# EAGLE schematic Calliope mini rev1.3 (EAGLE 7.7.0)
Assembly variants: -1

## Sheet 1 of 2
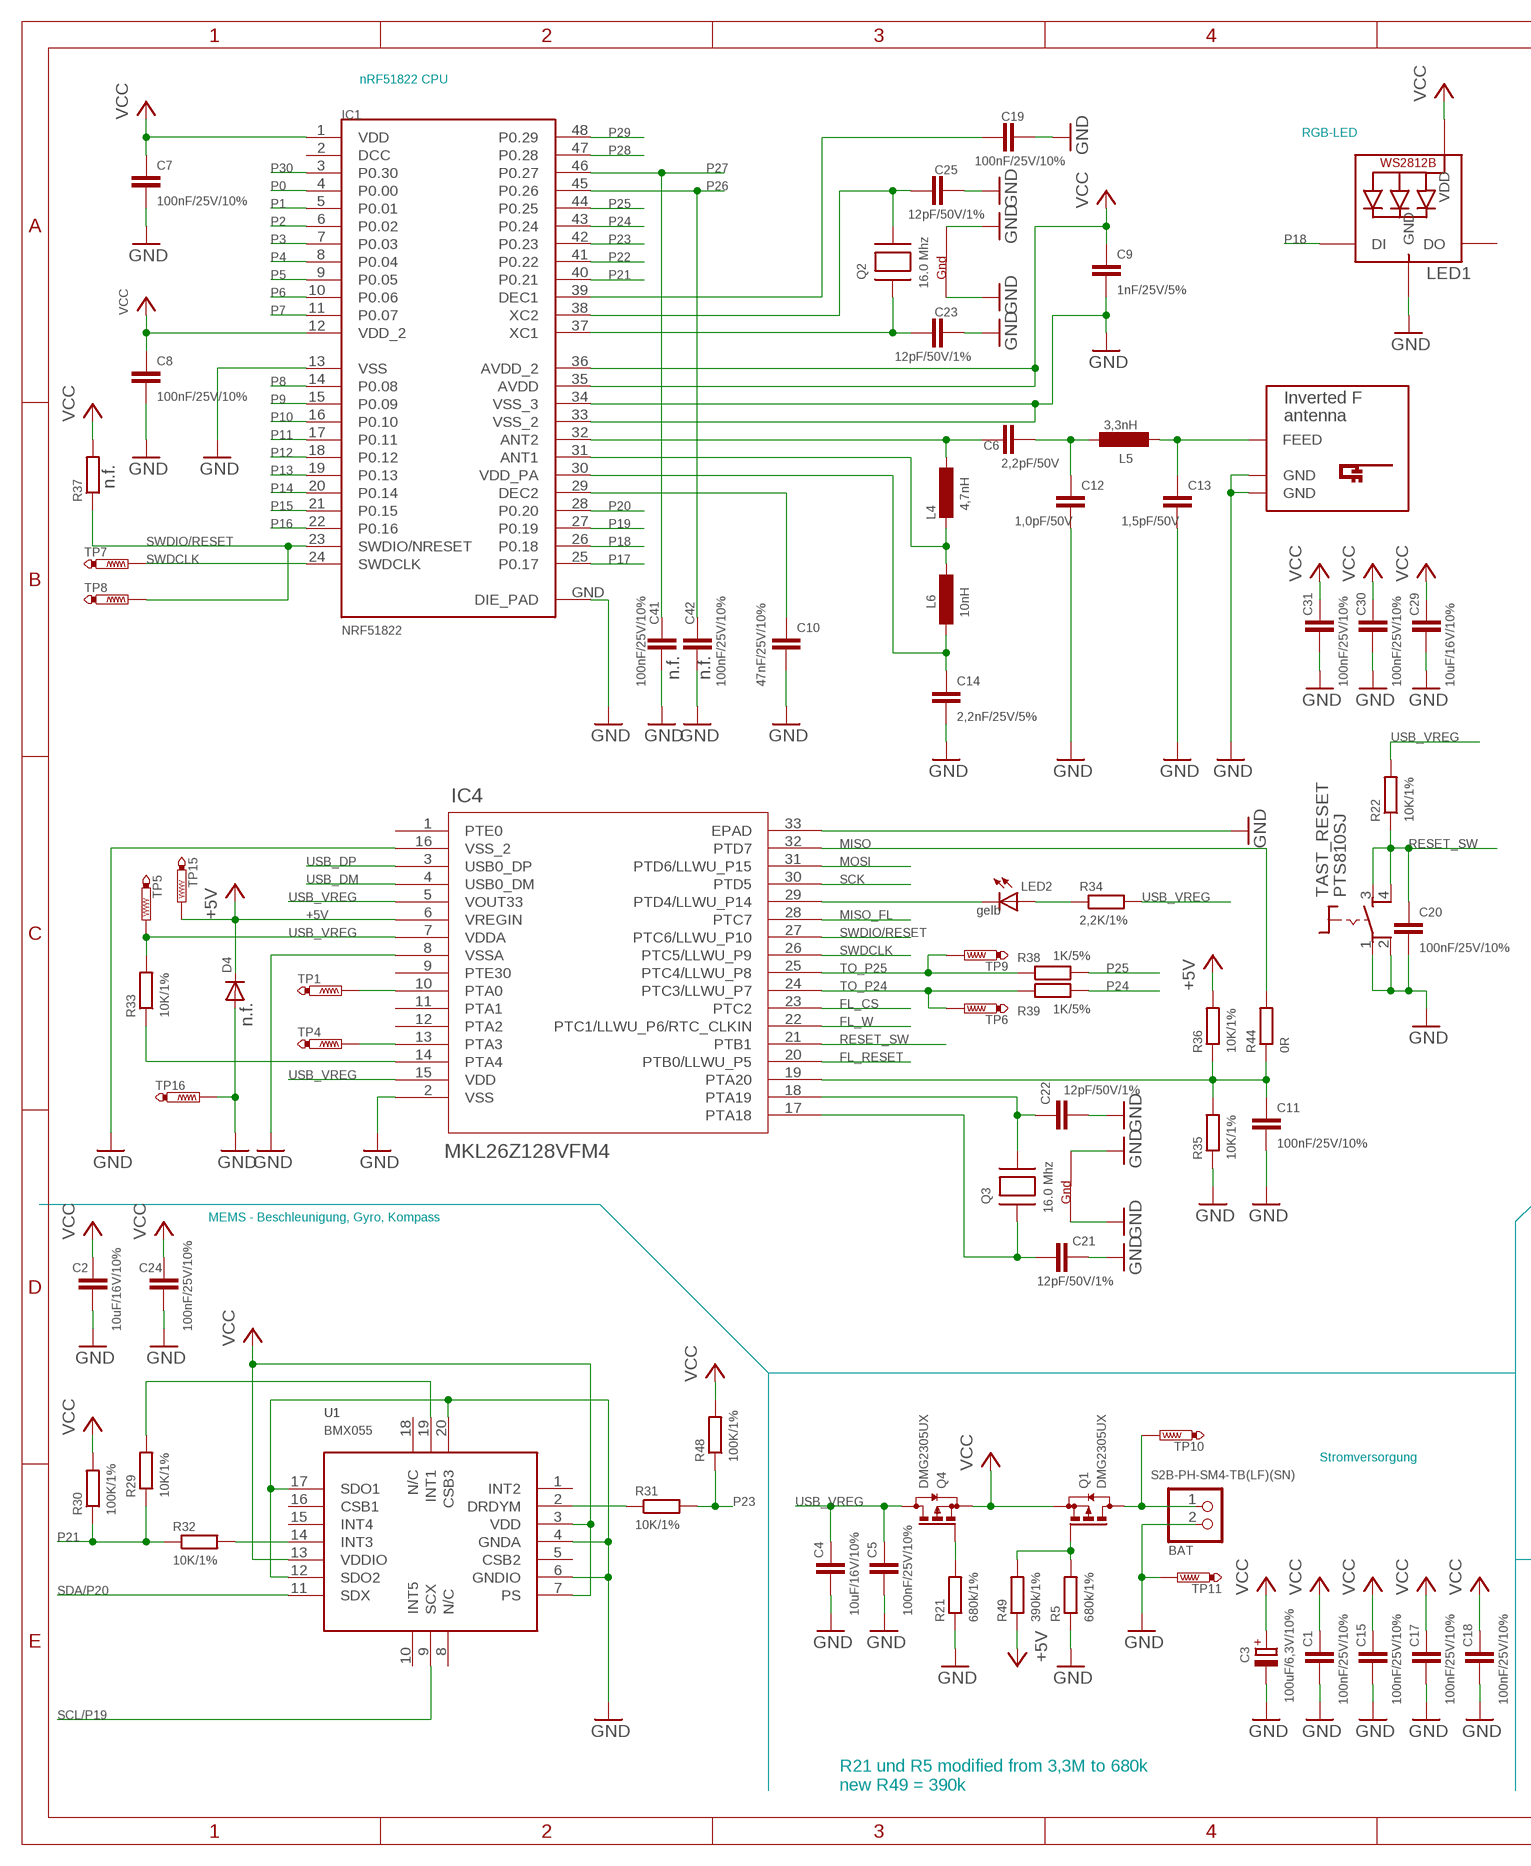
[diagram p0: schematic, sheet 1, part 1 of 2]
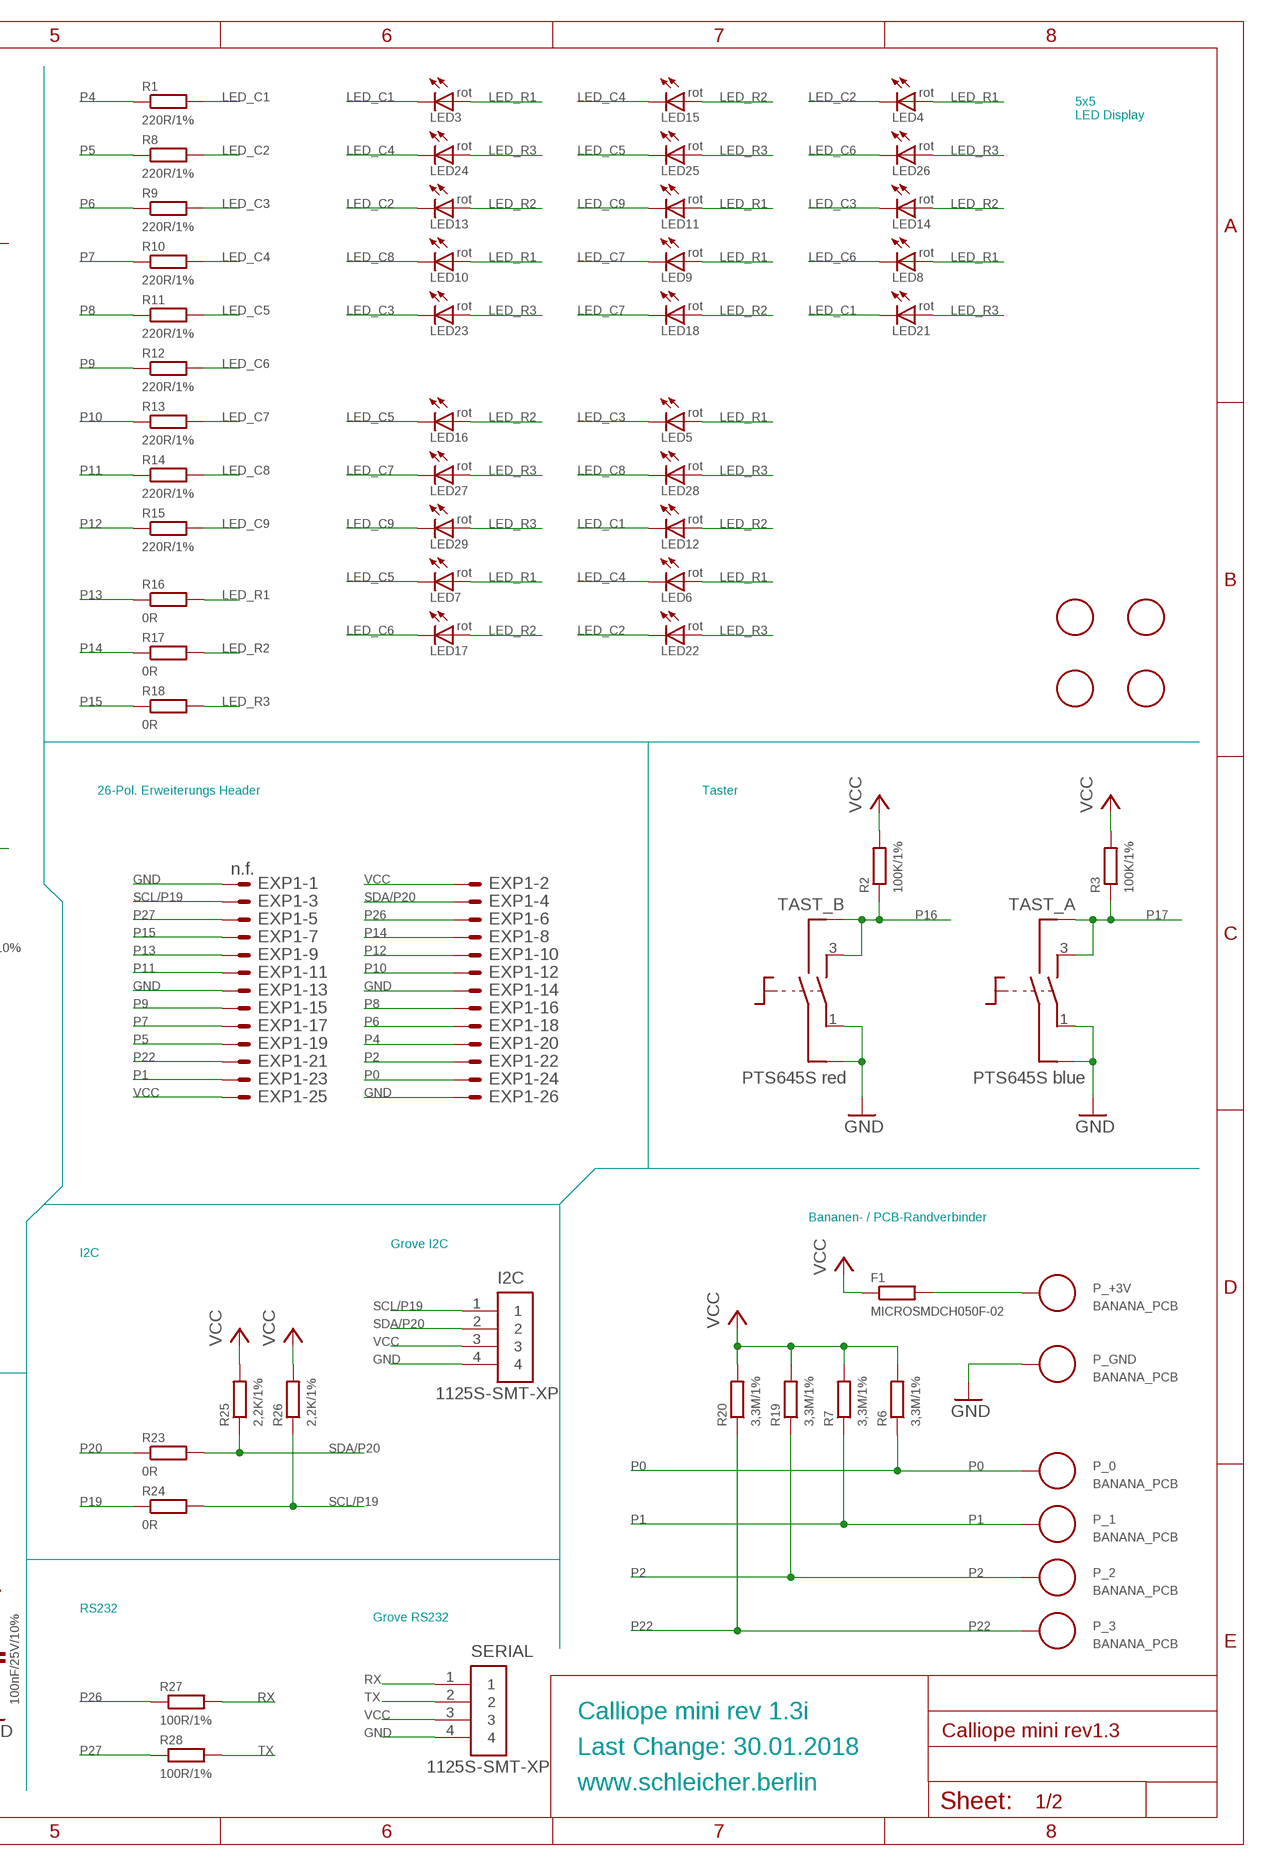
[diagram p1: schematic, sheet 1, part 2 of 2]

### Parts
BAT  S2B-PH-SM4-TB(LF)(SN)  JST_2PIN-SMT-RA  [JST-PH-2-SMT-RA]
C1  100nF/25V/10%  C-EU0402  [0402]
C2  10uF/16V/10%  C-EU0603  [0603]
C3  100uF/6,3V/10%  CPOL-EUD/7343-31R  [D/7343-31R]
C4  10uF/16V/10%  C-EU0603  [0603]
C5  100nF/25V/10%  C-EU0402  [0402]
C6  2,2pF/50V  C-EU0402  [0402]
C7  100nF/25V/10%  C-EU0402  [0402]
C8  100nF/25V/10%  C-EU0402  [0402]
C9  1nF/25V/5%  C-EU0402  [0402]
C10  47nF/25V/10%  C-EU0402  [0402]
C11  100nF/25V/10%  C-EU0402  [0402]
C12  1,0pF/50V  C-EU0402  [0402]
C13  1,5pF/50V  C-EU0402  [0402]
C14  2,2nF/25V/5%  C-EU0402  [0402]
C15  100nF/25V/10%  C-EU0402  [0402]
C17  100nF/25V/10%  C-EU0402  [0402]
C18  100nF/25V/10%  C-EU0402  [0402]
C19  100nF/25V/10%  C-EU0402  [0402]
C20  100nF/25V/10%  C-EU0402  [0402]
C21  12pF/50V/1%  C-EU0402  [0402]
C22  12pF/50V/1%  C-EU0402  [0402]
C23  12pF/50V/1%  C-EU0402  [0402]
C24  100nF/25V/10%  C-EU0402  [0402]
C25  12pF/50V/1%  C-EU0402  [0402]
C29  10uF/16V/10%  C-EU0603  [0603]
C30  100nF/25V/10%  C-EU0402  [0402]
C31  100nF/25V/10%  C-EU0402  [0402]
C41  100nF/25V/10%  C-EU0402  [0402]  (not fitted in variant -1)
C42  100nF/25V/10%  C-EU0402  [0402]  (not fitted in variant -1)
D4  DIODE-SOD323-R  [SOD323-R]  (not fitted in variant -1)
EXP1  ML26E  [ML26]  (not fitted in variant -1)
F1  MICROSMDCH050F-02  R-EU_R1210  [R1210]
I2C  1125S-SMT-XP  [1125S-SMT-XP]
IC1  NRF51822  [QFN48]
IC4  MKL26Z128VFM4  MKL26Z  [QFN_32_5X5X0P9]
L4  4,7nH  L-EU0402  [0402]
L5  3,3nH  L-EU0402  [0402]
L6  10nH  L-EU0402  [0402]
LED1  SK6812MINI  WS2812B3535  [LED3535]
LED2  gelb  LEDCHIPLED_0603  [CHIPLED_0603]
LED3  rot  LEDCHIPLED_0603  [CHIPLED_0603]
LED4  rot  LEDCHIPLED_0603  [CHIPLED_0603]
LED5  rot  LEDCHIPLED_0603  [CHIPLED_0603]
LED6  rot  LEDCHIPLED_0603  [CHIPLED_0603]
LED7  rot  LEDCHIPLED_0603  [CHIPLED_0603]
LED8  rot  LEDCHIPLED_0603  [CHIPLED_0603]
LED9  rot  LEDCHIPLED_0603  [CHIPLED_0603]
LED10  rot  LEDCHIPLED_0603  [CHIPLED_0603]
LED11  rot  LEDCHIPLED_0603  [CHIPLED_0603]
LED12  rot  LEDCHIPLED_0603  [CHIPLED_0603]
LED13  rot  LEDCHIPLED_0603  [CHIPLED_0603]
LED14  rot  LEDCHIPLED_0603  [CHIPLED_0603]
LED15  rot  LEDCHIPLED_0603  [CHIPLED_0603]
LED16  rot  LEDCHIPLED_0603  [CHIPLED_0603]
LED17  rot  LEDCHIPLED_0603  [CHIPLED_0603]
LED18  rot  LEDCHIPLED_0603  [CHIPLED_0603]
LED21  rot  LEDCHIPLED_0603  [CHIPLED_0603]
LED22  rot  LEDCHIPLED_0603  [CHIPLED_0603]
LED23  rot  LEDCHIPLED_0603  [CHIPLED_0603]
LED24  rot  LEDCHIPLED_0603  [CHIPLED_0603]
LED25  rot  LEDCHIPLED_0603  [CHIPLED_0603]
LED26  rot  LEDCHIPLED_0603  [CHIPLED_0603]
LED27  rot  LEDCHIPLED_0603  [CHIPLED_0603]
LED28  rot  LEDCHIPLED_0603  [CHIPLED_0603]
LED29  rot  LEDCHIPLED_0603  [CHIPLED_0603]
P_0  BANANA_PCB  [BANANA_REC]  (not fitted in variant -1)
P_1  BANANA_PCB  [BANANA_REC]  (not fitted in variant -1)
P_2  BANANA_PCB  [BANANA_REC]  (not fitted in variant -1)
P_3  BANANA_PCB  [BANANA_REC]  (not fitted in variant -1)
P_+3V  BANANA_PCB  [BANANA_REC]  (not fitted in variant -1)
P_GND  BANANA_PCB  [BANANA_REC]  (not fitted in variant -1)
Q1  DMG2305UX  BSS84  [SOT23]
Q2  16.0 Mhz  XTAL-4-3225  [NX3225]
Q3  16.0 Mhz  XTAL-4-3225  [NX3225]
Q4  DMG2305UX  BSS84  [SOT23]
R1  220R/1%  R-EU_0402  [0402]
R2  100K/1%  R-EU_0402  [0402]
R3  100K/1%  R-EU_0402  [0402]
R5  680k/1%  R-EU_0402  [0402]
R6  3,3M/1%  R-EU_0402  [0402]
R7  3,3M/1%  R-EU_0402  [0402]
R8  220R/1%  R-EU_0402  [0402]
R9  220R/1%  R-EU_0402  [0402]
R10  220R/1%  R-EU_0402  [0402]
R11  220R/1%  R-EU_0402  [0402]
R12  220R/1%  R-EU_0402  [0402]
R13  220R/1%  R-EU_0402  [0402]
R14  220R/1%  R-EU_0402  [0402]
R15  220R/1%  R-EU_0402  [0402]
R16  0R  R-EU_0402  [0402]
R17  0R  R-EU_0402  [0402]
R18  0R  R-EU_0402  [0402]
R19  3,3M/1%  R-EU_0402  [0402]
R20  3,3M/1%  R-EU_0402  [0402]
R21  680k/1%  R-EU_0402  [0402]
R22  10K/1%  R-EU_0402  [0402]
R23  0R  R-EU_0402  [0402]
R24  0R  R-EU_0402  [0402]
R25  2,2K/1%  R-EU_0402  [0402]
R26  2,2K/1%  R-EU_0402  [0402]
R27  100R/1%  R-EU_0402  [0402]
R28  100R/1%  R-EU_0402  [0402]
R29  10K/1%  R-EU_0402  [0402]
R30  100K/1%  R-EU_0402  [0402]
R31  10K/1%  R-EU_0402  [0402]
R32  10K/1%  R-EU_0402  [0402]
R33  10K/1%  R-EU_0402  [0402]
R34  2,2K/1%  R-EU_0402  [0402]
R35  10K/1%  R-EU_0402  [0402]
R36  10K/1%  R-EU_0402  [0402]
R37  R-EU_0402  [0402]  (not fitted in variant -1)
R38  1K/5%  R-EU_0402  [0402]
R39  1K/5%  R-EU_0402  [0402]
R44  0R  R-EU_0402  [0402]
R48  100K/1%  R-EU_0402  [0402]
R49  390k/1%  R-EU_0402  [0402]
SERIAL  1125S-SMT-XP  [1125S-SMT-XP]
TAST_A  PTS645S blue  PTS645S  [PTS645S]
TAST_B  PTS645S red  PTS645S  [PTS645S]
TAST_RESET  PTS810SJ  [PTS810]
TP1  PTR1B1,27  [B1,27]  (not fitted in variant -1)
TP4  PTR1B1,27  [B1,27]  (not fitted in variant -1)
TP5  PTR1B1,27  [B1,27]  (not fitted in variant -1)
TP6  PTR1B1,27  [B1,27]  (not fitted in variant -1)
TP7  PTR1B1,27  [B1,27]  (not fitted in variant -1)
TP8  PTR1B1,27  [B1,27]  (not fitted in variant -1)
TP9  PTR1B1,27  [B1,27]  (not fitted in variant -1)
TP10  PTR1B1,27  [B1,27]  (not fitted in variant -1)
TP11  PTR1B1,27  [B1,27]  (not fitted in variant -1)
TP15  PTR1B1,27  [B1,27]  (not fitted in variant -1)
TP16  PTR1B1,27  [B1,27]  (not fitted in variant -1)
U1  BMX055  [BMX055]
U$2  INVERTED_F_ANTENNA  [DN0007+0_MIRROR]  (not fitted in variant -1)
U$5  FIDUCIAL  [FIDUCIAL_1MM]  (not fitted in variant -1)
U$6  FIDUCIAL  [FIDUCIAL_1MM]  (not fitted in variant -1)
U$7  FIDUCIAL  [FIDUCIAL_1MM]  (not fitted in variant -1)
U$8  FIDUCIAL  [FIDUCIAL_1MM]  (not fitted in variant -1)

### Nets
+5V: D4.C IC4.6(VREGIN) R36.2 R49.1 TP15.TP ; also sheet 2
FL_CS: IC4.23(PTC2) ; also sheet 2
FL_RESET: IC4.20(PTB0/LLWU_P5) ; also sheet 2
FL_W: IC4.22(PTC1/LLWU_P6/RTC_CLKIN) ; also sheet 2
GND: BAT.2 C1.2 C2.2 C3.- C4.2 C5.2 C7.2 C8.2 C9.2 C10.2 C11.2 C12.2 C13.2 C14.2 C15.2 C17.2 C18.2 C19.2 C20.2 C21.2 C22.2 C23.2 C24.2 C25.2 C29.2 C30.2 C31.2 C41.2 C42.2 D4.A EXP1.1 EXP1.13 EXP1.14 EXP1.26 I2C.4 IC1.13(VSS) IC1.33(VSS_2) IC1.34(VSS_3) IC1.GND(DIE_PAD) IC4.2(VSS) IC4.8(VSSA) IC4.16(VSS_2) IC4.33(EPAD) LED1.4(GND) P_GND.1 Q2.2(G2) Q2.4(G1) Q3.2(G2) Q3.4(G1) R5.1 R21.1 R35.1 SERIAL.4 TAST_A.1 TAST_A.2 TAST_B.1 TAST_B.2 TAST_RESET.1(P) TAST_RESET.2(P1) TP11.TP TP16.TP U1.4(GNDA) U1.6(GNDIO) U1.12(SDO2) U1.17(SDO1) U1.20(CSB3) U$2.GND U$2.GND@1(GND) ; also sheet 2
LED_C1: LED3.A LED12.A LED21.A R1.2
LED_C2: LED4.A LED13.A LED22.A R8.2
LED_C3: LED5.A LED14.A LED23.A R9.2
LED_C4: LED6.A LED15.A LED24.A R10.2
LED_C5: LED7.A LED16.A LED25.A R11.2
LED_C6: LED8.A LED17.A LED26.A R12.2
LED_C7: LED9.A LED18.A LED27.A R13.2
LED_C8: LED10.A LED28.A R14.2
LED_C9: LED11.A LED29.A R15.2
LED_R1: LED3.C LED4.C LED5.C LED6.C LED7.C LED8.C LED9.C LED10.C LED11.C R16.2
LED_R2: LED12.C LED13.C LED14.C LED15.C LED16.C LED17.C LED18.C R17.2
LED_R3: LED21.C LED22.C LED23.C LED24.C LED25.C LED26.C LED27.C LED28.C LED29.C R18.2
MISO: IC4.32(PTD7) R44.2 ; also sheet 2
MISO_FL: IC4.28(PTC7) ; also sheet 2
MOSI: IC4.31(PTD6/LLWU_P15) ; also sheet 2
N$2: C25.1 IC1.38(XC2) Q2.3(X2)
N$3: R29.2 U1.19(INT1)
N$4: IC4.14(PTA4) R33.1
N$5: IC4.29(PTD4/LLWU_P14) LED2.A
N$6: R32.2 U1.14(INT3)
N$7: Q1.1(G) R5.2 R49.2
N$8: LED2.C R34.1
N$9: F1.2 P_+3V.1
N$11: C22.1 IC4.18(PTA19) Q3.3(X2)
N$13: C23.1 IC1.37(XC1) Q2.1(X1)
N$14: C14.1 IC1.30(VDD_PA) L6.1
N$15: C6.1 IC1.32(ANT2) L4.1
N$16: C6.2 C12.1 L5.1
N$17: C13.1 L5.2 U$2.FEED
N$18: IC1.31(ANT1) L4.2 L6.2
N$19: C19.1 IC1.39(DEC1)
N$20: C21.1 IC4.17(PTA18) Q3.1(X1)
N$21: Q4.1(G) R21.2
N$22: C10.1 IC1.29(DEC2)
N$23: R31.1 U1.2(DRDYM)
N$27: C11.1 IC4.19(PTA20) R35.2 R36.1 R44.1
P0: EXP1.24 IC1.4(P0.00) P_0.1 R6.1
P1: EXP1.23 IC1.5(P0.01) P_1.1 R7.1
P2: EXP1.22 IC1.6(P0.02) P_2.1 R19.1
P3: IC1.7(P0.03) ; also sheet 2
P4: EXP1.20 IC1.8(P0.04) R1.1
P5: EXP1.19 IC1.9(P0.05) R8.1
P6: EXP1.18 IC1.10(P0.06) R9.1
P7: EXP1.17 IC1.11(P0.07) R10.1
P8: EXP1.16 IC1.14(P0.08) R11.1
P9: EXP1.15 IC1.15(P0.09) R12.1
P10: EXP1.12 IC1.16(P0.10) R13.1
P11: EXP1.11 IC1.17(P0.11) R14.1
P12: EXP1.10 IC1.18(P0.12) R15.1
P13: EXP1.9 IC1.19(P0.13) R16.1
P14: EXP1.8 IC1.20(P0.14) R17.1
P15: EXP1.7 IC1.21(P0.15) R18.1
P16: IC1.22(P0.16) R2.1 TAST_B.3(S1) TAST_B.4(S2)
P17: IC1.25(P0.17) R3.1 TAST_A.3(S1) TAST_A.4(S2)
P18: IC1.26(P0.18) LED1.1(DI)
P19: IC1.27(P0.19) R24.1
P20: IC1.28(P0.20) R23.1
P21: IC1.40(P0.21) R29.1 R30.1 R32.1
P22: EXP1.21 IC1.41(P0.22) P_3.1 R20.1
P23: IC1.42(P0.23) R31.2 R48.1
P24: IC1.43(P0.24) R39.2
P25: IC1.44(P0.25) R38.2
P26: C42.1 EXP1.6 IC1.45(P0.26) R27.1
P27: C41.1 EXP1.5 IC1.46(P0.27) R28.1
P28: IC1.47(P0.28) ; also sheet 2
P29: IC1.48(P0.29) ; also sheet 2
P30: IC1.3(P0.30) ; also sheet 2
RESET_SW: C20.1 IC4.21(PTB1) R22.1 TAST_RESET.3(S) TAST_RESET.4(S1)
RX: R27.2 SERIAL.1
SCK: IC4.30(PTD5) ; also sheet 2
SCL/P19: EXP1.3 I2C.1 R24.2 R26.1 U1.9(SCX)
SDA/P20: EXP1.4 I2C.2 R23.2 R25.1 U1.11(SDX)
SWCLK: IC4.10(PTA0) TP1.TP
SWDCLK: IC1.24(SWDCLK) IC4.26(PTC5/LLWU_P9) TP7.TP
SWDIO: IC4.13(PTA3) TP4.TP
SWDIO/RESET: IC1.23(SWDIO/NRESET) IC4.27(PTC6/LLWU_P10) R37.1 TP8.TP
TO_P24: IC4.24(PTC3/LLWU_P7) R39.1 TP6.TP
TO_P25: IC4.25(PTC4/LLWU_P8) R38.1 TP9.TP
TX: R28.2 SERIAL.2
USB_DM: IC4.4(USB0_DM) ; also sheet 2
USB_DP: IC4.3(USB0_DP) ; also sheet 2
USB_VREG: C4.1 C5.1 IC4.5(VOUT33) IC4.7(VDDA) IC4.15(VDD) Q4.3(D) R22.2 R33.2 R34.2 TP5.TP ; also sheet 2
VCC: C1.1 C2.1 C3.+ C7.1 C8.1 C9.1 C15.1 C17.1 C18.1 C24.1 C29.1 C30.1 C31.1 EXP1.2 EXP1.25 F1.1 I2C.3 IC1.1(VDD) IC1.12(VDD_2) IC1.35(AVDD) IC1.36(AVDD_2) LED1.2(VDD) Q1.2(S) Q4.2(S) R2.2 R3.2 R6.2 R7.2 R19.2 R20.2 R25.2 R26.2 R30.2 R37.2 R48.2 SERIAL.3 U1.3(VDD) U1.7(PS) U1.13(VDDIO) ; also sheet 2
VIN: BAT.1 Q1.3(D) TP10.TP
Unconnected: IC1.2(DCC) IC4.1(PTE0) IC4.9(PTE30) IC4.11(PTA1) IC4.12(PTA2) LED1.3(DO) U1.1(INT2) U1.5(CSB2) U1.8(N/C) U1.10(INT5) U1.15(INT4) U1.16(CSB1) U1.18(N/C)

### Notes on the sheet
- nRF51822 CPU
- 5x5
  LED Display
- RGB-LED
- LED1
- 26-Pol. Erweiterungs Header | Taster
- MEMS - Beschleunigung, Gyro, Kompass | Bananen- / PCB-Randverbinder
- Grove I2C
- I2C
- Stromversorgung
- RS232
- Grove RS232
- Calliope mini rev 1.3i
- Last Change: 30.01.2018
- R21 und R5 modified from 3,3M to 680k
  new R49 = 390k
- www.schleicher.berlin

## Sheet 2 of 2
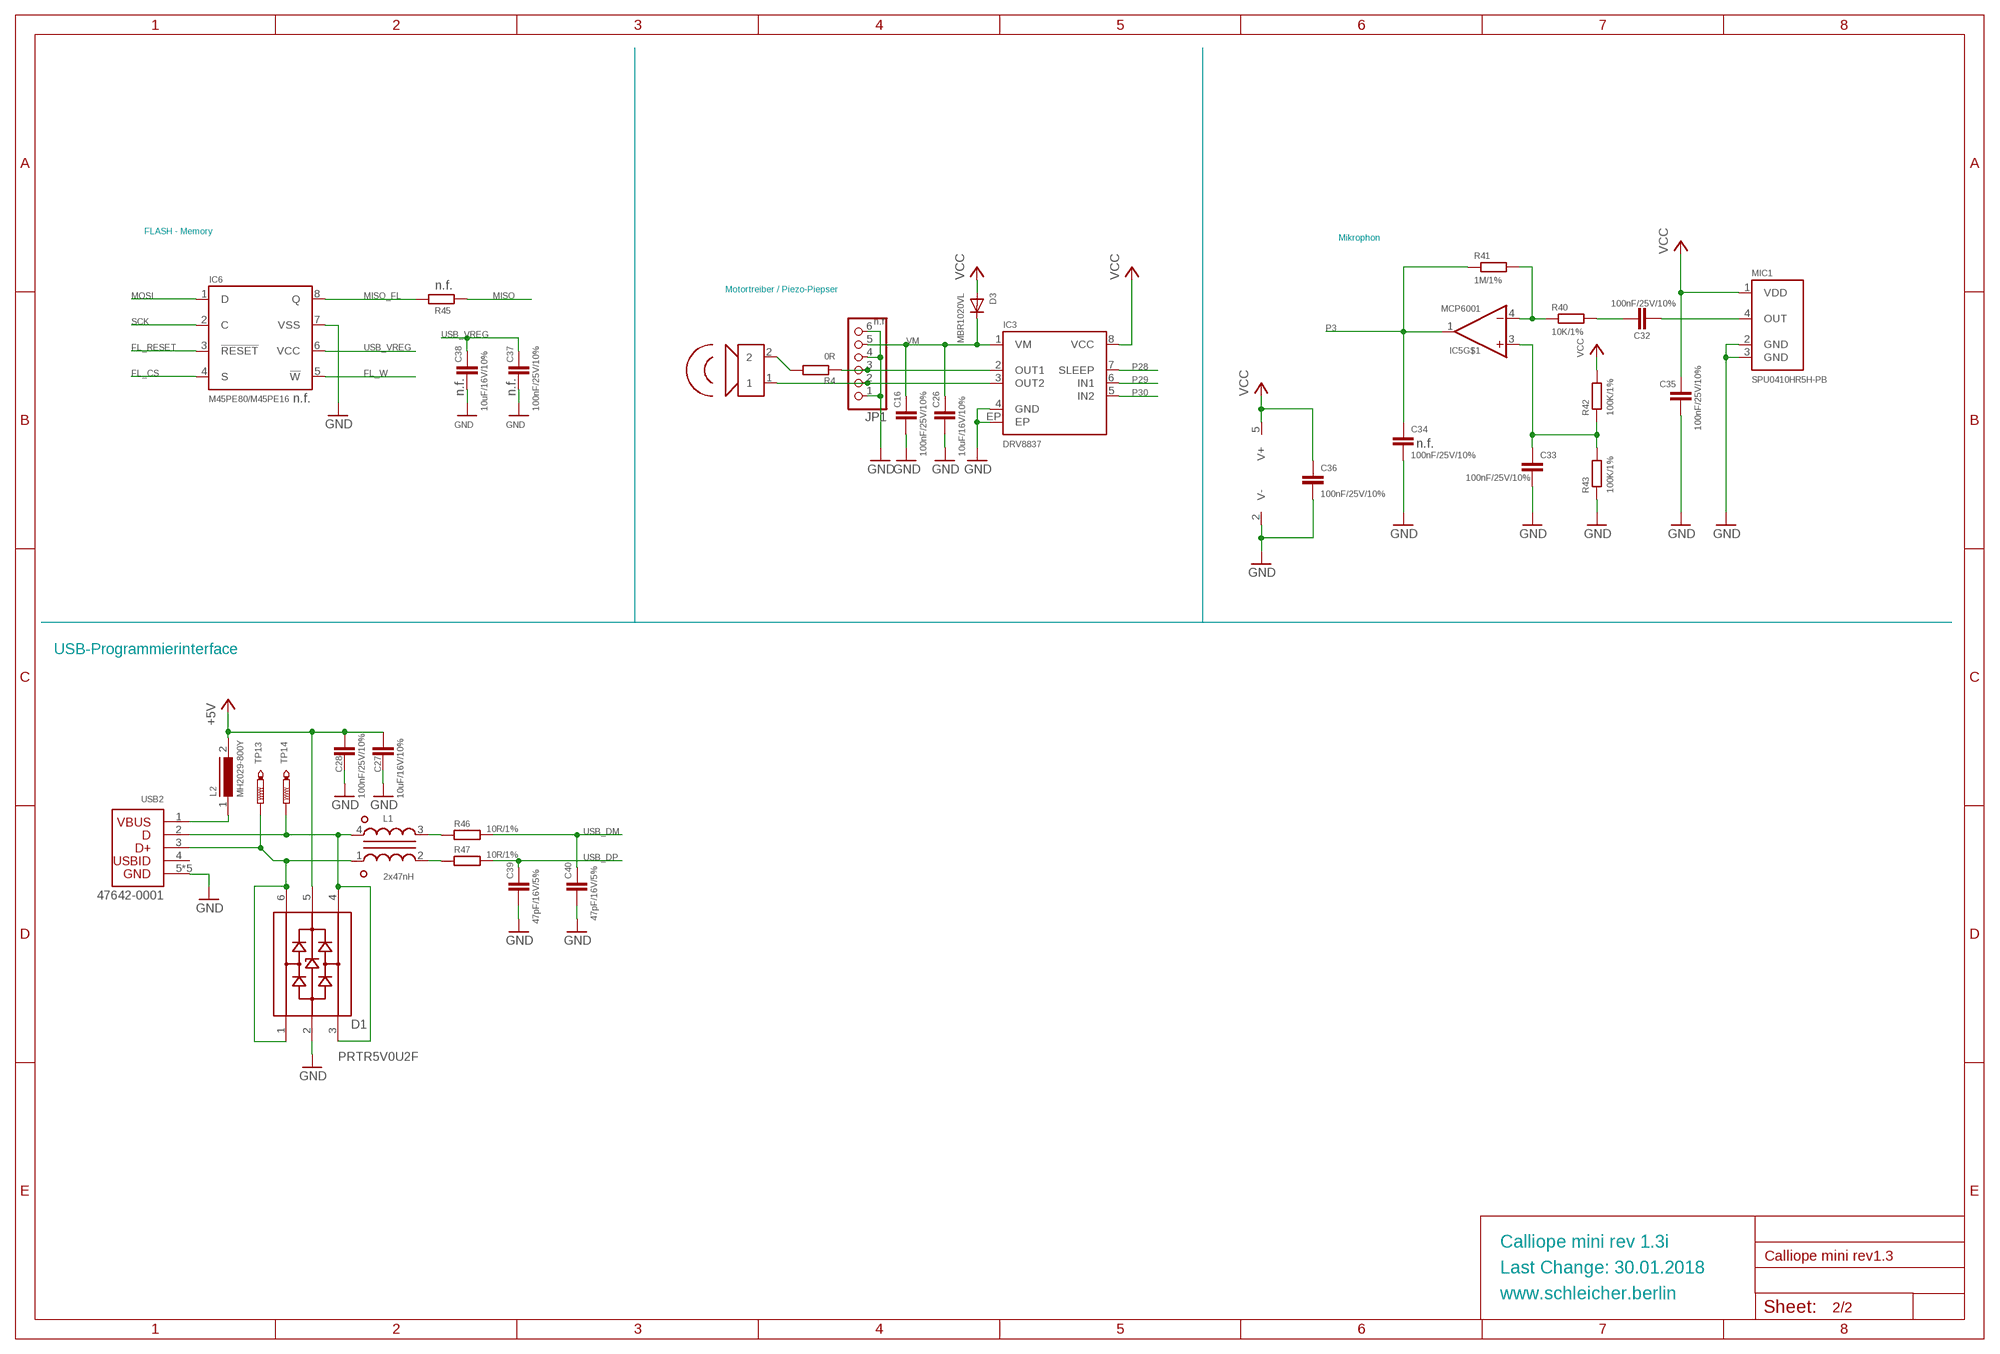
[diagram p2: schematic, sheet 2]

### Parts
C16  100nF/25V/10%  C-EU0402  [0402]
C26  10uF/16V/10%  C-EU0603  [0603]
C27  10uF/16V/10%  C-EU0603  [0603]
C28  100nF/25V/10%  C-EU0402  [0402]
C32  100nF/25V/10%  C-EU0402  [0402]
C33  100nF/25V/10%  C-EU0402  [0402]
C34  100nF/25V/10%  C-EU0402  [0402]  (not fitted in variant -1)
C35  100nF/25V/10%  C-EU0402  [0402]
C36  100nF/25V/10%  C-EU0402  [0402]
C37  100nF/25V/10%  C-EU0402  [0402]  (not fitted in variant -1)
C38  10uF/16V/10%  C-EU0603  [0603]  (not fitted in variant -1)
C39  47pF/16V/5%  C-EU0402  [0402]
C40  47pF/16V/5%  C-EU0402  [0402]
D1  PRTR5V0U2F  [SOT886]
D3  MBR1020VL  DIODE_SOD-123FL  [SOD-123FL]
IC3  DRV8837  [WSON8]
IC5  MCP6001  OPAMP_SINGLESOT23-5  [SOT23-5]
IC6  M45PE80/M45PE16  M45PE  [VQFN8_6X5]  (not fitted in variant -1)
JP1  PINHD-1X6-OFF  [1X06-OFF]
L1  2x47nH  0805USB-901MLC  [USB_2.0_FILTER_0805]
L2  MH2029-800Y  [FERRIT_0805]
MIC1  SPU0410HR5H-PB  [SPU0410HR5H-PB]
R4  0R  R-EU_0402  [0402]
R40  10K/1%  R-EU_0402  [0402]
R41  1M/1%  R-EU_0402  [0402]
R42  100K/1%  R-EU_0402  [0402]
R43  100K/1%  R-EU_0402  [0402]
R45  R-EU_0402  [0402]  (not fitted in variant -1)
R46  10R/1%  R-EU_R0603  [R0603]
R47  10R/1%  R-EU_R0603  [R0603]
SPK1  PKMCS0909E4000-R1  [PKMCS]
TP13  PTR1B1,27  [B1,27]  (not fitted in variant -1)
TP14  PTR1B1,27  [B1,27]  (not fitted in variant -1)
USB2  47642-0001  [47642-0001]

### Nets
+5V: C27.1 C28.1 D1.5 L2.2 ; also sheet 1
FL_CS: IC6.4(S) ; also sheet 1
FL_RESET: IC6.3(!RESET) ; also sheet 1
FL_W: IC6.5(!W) ; also sheet 1
GND: C16.2 C26.2 C27.2 C28.2 C33.2 C34.2 C35.2 C36.2 C37.2 C38.2 C39.2 C40.2 D1.2 IC3.4(GND) IC3.EP IC5.2(V-) IC6.7(VSS) JP1.1 JP1.4 JP1.6 MIC1.2(GND) MIC1.3(GND) R43.1 USB2.5 USB2.P$1 USB2.P$2 USB2.P$3 USB2.P$4 ; also sheet 1
MISO: R45.1 ; also sheet 1
MISO_FL: IC6.8(Q) R45.2 ; also sheet 1
MOSI: IC6.1(D) ; also sheet 1
N$1: IC3.3(OUT2) JP1.2 SPK1.1
N$10: IC3.2(OUT1) JP1.3 R4.1
N$12: R4.2 SPK1.2
N$24: C33.1 IC5.3(+IN) R42.1 R43.2
N$25: L2.1 USB2.1
N$26: D1.1 D1.6 L1.1 TP13.TP USB2.3
N$28: D1.3 D1.4 L1.4 TP14.TP USB2.2
N$29: IC5.4(-IN) R40.1 R41.2
N$30: C32.1 R40.2
N$31: C32.2 MIC1.4(OUT)
N$33: L1.3 R46.1
N$34: L1.2 R47.1
P3: C34.1 IC5.1(OUT) R41.1 ; also sheet 1
P28: IC3.7(SLEEP) ; also sheet 1
P29: IC3.6(IN1) ; also sheet 1
P30: IC3.5(IN2) ; also sheet 1
SCK: IC6.2(C) ; also sheet 1
USB_DM: C40.1 R46.2 ; also sheet 1
USB_DP: C39.1 R47.2 ; also sheet 1
USB_VREG: C37.1 C38.1 IC6.6(VCC) ; also sheet 1
VCC: C35.1 C36.1 D3.A IC3.8(VCC) IC5.5(V+) MIC1.1(VDD) R42.2 ; also sheet 1
VM: C16.1 C26.1 D3.C IC3.1(VM) JP1.5
Unconnected: USB2.4

### Notes on the sheet
- FLASH - Memory
- Mikrophon
- Motortreiber / Piezo-Piepser
- n.f.
- USB-Programmierinterface
- Calliope mini rev 1.3i
- Last Change: 30.01.2018
- www.schleicher.berlin

## Library data of the parts
BAT = adafruit:JST_2PIN: JST 2-Pin Connectors of various flavors SMT-RA (S2B-PH-SM4) 4UConnector #17311 SMT (B2B-PH-SM4) THM-RA (S2B-PH) THM (B2B-PH)
C1 C5 C7 C8 C10 C11 C15-C20 C24 C28 C30-C33 C35 C36 = rcl:C-EU: CAPACITOR, European symbol; ARTICLE_NUMBER_SCHLEICHER: RC.067.0150.0
C2 C4 C6 C9 C12-C14 C21-C23 C25-C27 C29 C39 C40 = rcl:C-EU: CAPACITOR, European symbol
C3 = resistor:CPOL-EU: POLARIZED CAPACITOR, European symbol
C34 C37 C41 C42 = rcl:C-EU: CAPACITOR, European symbol; ARTICLE_NUMBER_SCHLEICHER: RC.067.0150.0; MOUNTING: n.f.
C38 = rcl:C-EU: CAPACITOR, European symbol; MOUNTING: n.f.
D1 = diode:PRTR5V0U2*: Ultra low capacitance double rail-to-rail ESD protection; REVERSE_VOLTAGE: 5.5V
D3 = adafruit:DIODE: Diode SMADIODE - SMA Surface Mount Package 20V 1A Schottky Diode Digikey: 641-1014-6-ND DO-1N4148 - Through Hole Small Current Diode SOD-123 20V 1 A (.5mV Vf) Schottky Diode - Digikey: MBRX120TPMSCT-ND SOD-323 10V 570mA (.38mV Vf, 3ns) Schottky Diode - Digikey: ZLLS410CT-ND SOD-523 30V 30mA Schottky Diode (RB751S-40TE61) - Digikey: RB751S-40TE61CT-ND SOT23-R/W - SOT23 Package (R = Solder Paste/Reflow Ovens, W = Hand-Soldering) BAT54Film 40V 300mA - Digikey: 497-7162-1-ND
D4 = diode:DIODE-: DIODE; MOUNTING: n.f.
EXP1 = con-harting-ml:ML26?E: HARTING; MOUNTING: n.f.; OC_FARNELL: unknown; OC_NEWARK: unknown
F1 R1-R21 R23-R28 R30 R34 R38 R39 R42-R44 R48 R49 = rcl:R-EU_: RESISTOR, European symbol
I2C SERIAL = Calliope:1125*-SMT-XP
IC1 = NordicSemi:NRF51822: Bluetooth 4.0 Low Energy/2.4Ghz NORDIC SEMICONDUCTOR; VALUE2: NRF51822-QFAA-R7
IC3 = Bjorn4:DRV8837
IC4 = nxp-mkl26z:MKL26Z
IC5 = Bjorn4:OPAMP_SINGLE
IC6 = Bjorn4:M45PE; MOUNTING: n.f.
JP1 = Calliope:PINHD-1X6-OFF: PIN HEADER
L1 = inductor-coilcraft:0805USB-901ML; ARTICLE_NUMBER_SCHLEICHER: RT.022.3601.0; CURRENT: 500mA; DCR: 0.17R; INDUCTANCE: 2x47nH
L2 = inductors:MH2029-*Y: Ferrit 80R 0805 Bourns; ARTICLE_NUMBER_SCHLEICHER: RT.024.2301.0; CURRENT: 3A; DCR: 40R; IMPEDANCE: 80R; TOLERANCE: +-25%
L4 = rcl:L-EU: INDUCTOR, European symbol; VALUE2: LQW15AN4N7B00D
L5 = rcl:L-EU: INDUCTOR, European symbol; VALUE2: LQW15AN3N3B80D
L6 = rcl:L-EU: INDUCTOR, European symbol; VALUE2: LQW15AN10NG00D
LED1 = adafruit:WS2812B
LED2 = led:LED: LED OSRAM: - CHIPLED LG R971, LG N971, LY N971, LG Q971, LY Q971, LO R971, LY R971 LH N974, LH R974 LS Q976, LO Q976, LY Q976 LO Q996 - Hyper CHIPLED LW Q18S LB Q993, LB Q99A, LB R99A - SideLED LS A670, LO A670, LY A670, LG A670, LP A670 LB A673, LV A673, LT A673, LW A673 LH A674 LY A675 LS A676, LA A676, LO A676, LY A676, LW A676 LS A679, LY A679, LG A679 - Hyper Micro SIDELED® LS Y876, LA Y876, LO Y876, LY Y876 LT Y87S - SmartLED LW L88C, LW L88S LB L89C, LB L89S, LG L890 LS L89K, LO L89K, LY L89K LS L896, LA L896, LO L896, LY L896 - TOPLED LS T670, LO T670, LY T670, LG T670, LP T670 LSG T670, LSP T670, LSY T670, LOP T670, LYG T670 LG T671, LOG T671, LSG T671 LB T673, LV T673, LT T673, LW T673 LH T674 LS T676, LA T676, LO T676, LY T676, LB T676, LH T676, LSB T676, LW T676 LB T67C, LV T67C, LT T67C, LS T67K, LO T67K, LY T67K, LW E67C LS E67B, LA E67B, LO E67B, LY E67B, LB E67C, LV E67C, LT E67C LW T67C LS T679, LY T679, LG T679 LS T770, LO T770, LY T770, LG T770, LP T770 LB T773, LV T773, LT T773, LW T773 LH T774 LS E675, LA E675, LY E675, LS T675 LS T776, LA T776, LO T776, LY T776, LB T776 LHGB T686 LT T68C, LB T68C - Hyper Mini TOPLED® LB M676 - Mini TOPLED Santana® LG M470 LS M47K, LO M47K, LY M47K Source: http://www.osram.convergy.de LUXEON: - LUMILED® LXK2-PW12-R00, LXK2-PW12-S00, LXK2-PW14-U00, LXK2-PW14-V00 LXK2-PM12-R00, LXK2-PM12-S00, LXK2-PM14-U00 LXK2-PE12-Q00, LXK2-PE12-R00, LXK2-PE12-S00, LXK2-PE14-T00, LXK2-PE14-U00 LXK2-PB12-K00, LXK2-PB12-L00, LXK2-PB12-M00, LXK2-PB14-N00, LXK2-PB14-P00, LXK2-PB14-Q00 LXK2-PR12-L00, LXK2-PR12-M00, LXK2-PR14-Q00, LXK2-PR14-R00 LXK2-PD12-Q00, LXK2-PD12-R00, LXK2-PD12-S00 LXK2-PH12-R00, LXK2-PH12-S00 LXK2-PL12-P00, LXK2-PL12-Q00, LXK2-PL12-R00 Source: www.luxeon.com KINGBRIGHT: KA-3528ASYC Source: www.kingbright.com; VALUE2: LTST-C191KSKT
LED3-LED18 LED21-LED29 = led:LED: LED OSRAM: - CHIPLED LG R971, LG N971, LY N971, LG Q971, LY Q971, LO R971, LY R971 LH N974, LH R974 LS Q976, LO Q976, LY Q976 LO Q996 - Hyper CHIPLED LW Q18S LB Q993, LB Q99A, LB R99A - SideLED LS A670, LO A670, LY A670, LG A670, LP A670 LB A673, LV A673, LT A673, LW A673 LH A674 LY A675 LS A676, LA A676, LO A676, LY A676, LW A676 LS A679, LY A679, LG A679 - Hyper Micro SIDELED® LS Y876, LA Y876, LO Y876, LY Y876 LT Y87S - SmartLED LW L88C, LW L88S LB L89C, LB L89S, LG L890 LS L89K, LO L89K, LY L89K LS L896, LA L896, LO L896, LY L896 - TOPLED LS T670, LO T670, LY T670, LG T670, LP T670 LSG T670, LSP T670, LSY T670, LOP T670, LYG T670 LG T671, LOG T671, LSG T671 LB T673, LV T673, LT T673, LW T673 LH T674 LS T676, LA T676, LO T676, LY T676, LB T676, LH T676, LSB T676, LW T676 LB T67C, LV T67C, LT T67C, LS T67K, LO T67K, LY T67K, LW E67C LS E67B, LA E67B, LO E67B, LY E67B, LB E67C, LV E67C, LT E67C LW T67C LS T679, LY T679, LG T679 LS T770, LO T770, LY T770, LG T770, LP T770 LB T773, LV T773, LT T773, LW T773 LH T774 LS E675, LA E675, LY E675, LS T675 LS T776, LA T776, LO T776, LY T776, LB T776 LHGB T686 LT T68C, LB T68C - Hyper Mini TOPLED® LB M676 - Mini TOPLED Santana® LG M470 LS M47K, LO M47K, LY M47K Source: http://www.osram.convergy.de LUXEON: - LUMILED® LXK2-PW12-R00, LXK2-PW12-S00, LXK2-PW14-U00, LXK2-PW14-V00 LXK2-PM12-R00, LXK2-PM12-S00, LXK2-PM14-U00 LXK2-PE12-Q00, LXK2-PE12-R00, LXK2-PE12-S00, LXK2-PE14-T00, LXK2-PE14-U00 LXK2-PB12-K00, LXK2-PB12-L00, LXK2-PB12-M00, LXK2-PB14-N00, LXK2-PB14-P00, LXK2-PB14-Q00 LXK2-PR12-L00, LXK2-PR12-M00, LXK2-PR14-Q00, LXK2-PR14-R00 LXK2-PD12-Q00, LXK2-PD12-R00, LXK2-PD12-S00 LXK2-PH12-R00, LXK2-PH12-S00 LXK2-PL12-P00, LXK2-PL12-Q00, LXK2-PL12-R00 Source: www.luxeon.com KINGBRIGHT: KA-3528ASYC Source: www.kingbright.com; VALUE2: LTST-C190KRKT
MIC1 = Bjorn4:SPU0410HR5H-PB
P_0 P_1-P_3 P_+3V P_GND = Bjorn4:BANANA_PCB
Q1 Q4 = transistor-small-signal:BSS84: P-CHANNEL MOS FET
Q2 Q3 = adafruit:XTAL-4: Classic 4-pin 3.2 x 2.5mm crystal; VALUE2: ABM8-16.000MHZ-7-1-U-T
R22 R29 R31-R33 R35 R36 R40 R41 = rcl:R-EU_: RESISTOR, European symbol; ARTICLE_NUMBER_SCHLEICHER: RR.110.0097.0
R37 R45 = rcl:R-EU_: RESISTOR, European symbol; MOUNTING: n.f.
R46 R47 = resistor:R-EU_: RESISTOR, European symbol
SPK1 = Bjorn4:PKMCS
TAST_A = Bjorn4:PTS645; VALUE2: PTS645SM43SMTR92 LFS
TAST_B = Bjorn4:PTS645; VALUE2: PTS645SK43SMTR92 LFS
TAST_RESET = Bjorn4:PTS810; VALUE2: PTS810 SJK 250 SMTR LFS
TP1 TP4-TP11 TP13-TP16 = testpad:PTR1: TEST PIN
U1 = x-io:BMX055
U$2 = antenna:INVERTED_F_ANTENNA: 2.4GHz Inverted F Antenna Based on TI Design Note DN007
U$5-U$8 = adafruit:FIDUCIAL: For use by pick and place machines to calibrate the vision/machine, 1mm By microbuilder.eu
USB2 = Calliope:47642-0001